# Altium project STM32_v1.PrjPcb
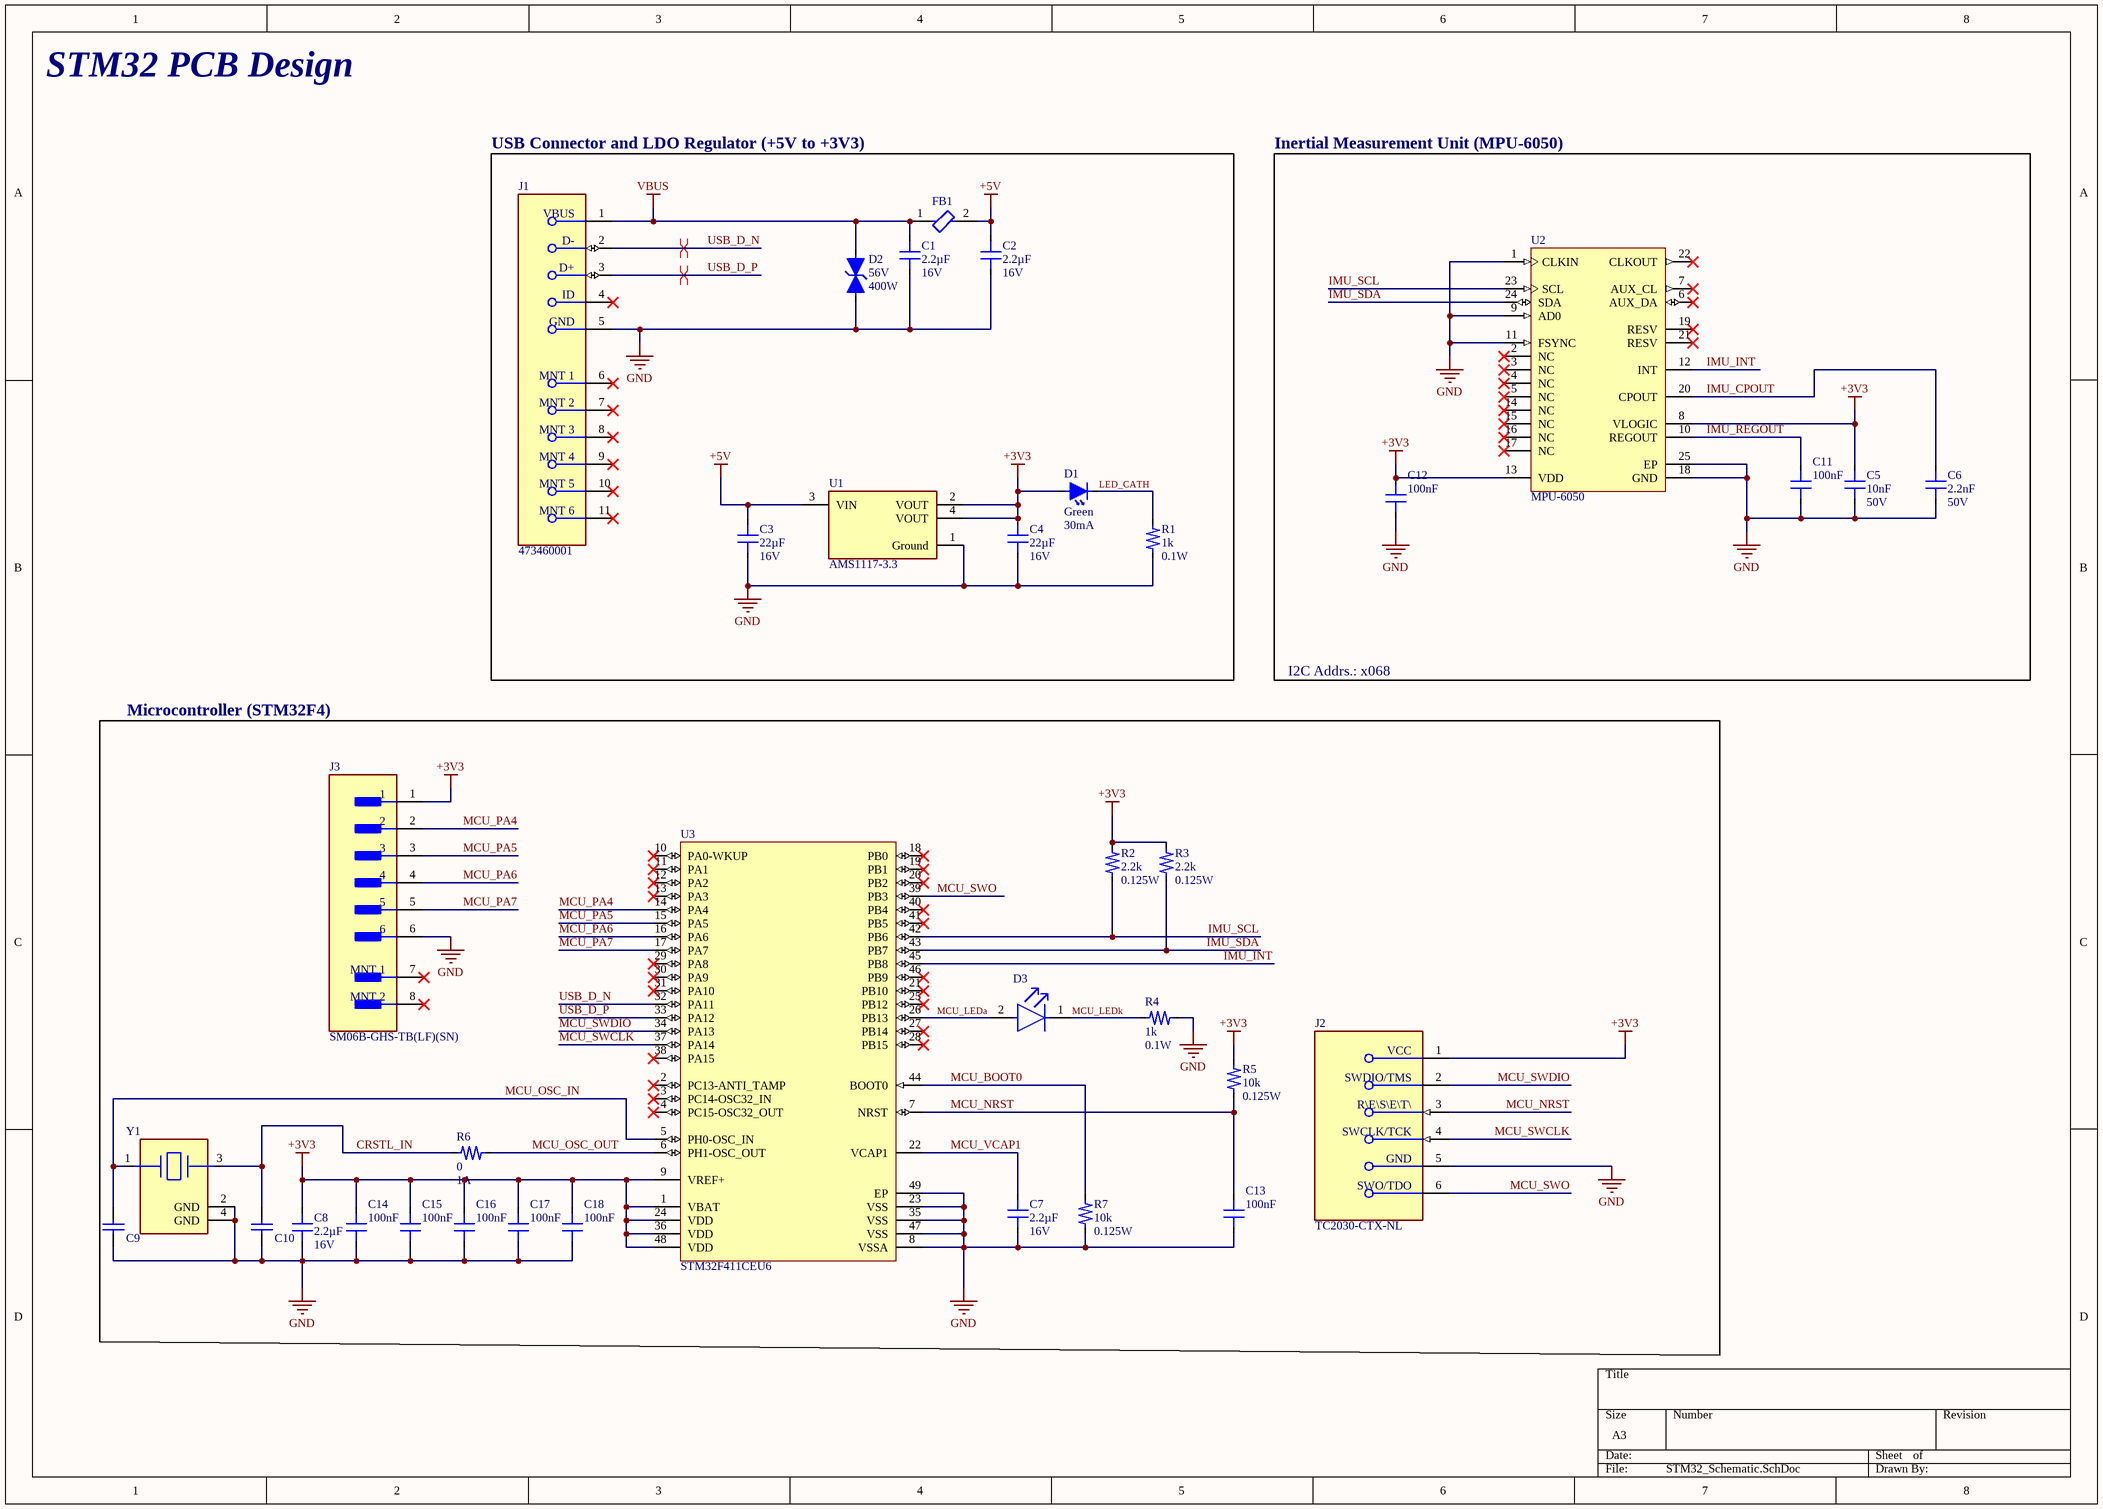
[diagram p0: STM32_Schematic.SchDoc]
1 sheet, 36 parts. Net scope: global (net labels, ports and power ports of the same name join across sheets).
Board file: STM32_PCB.PcbDoc

## Sheet STM32_Schematic.SchDoc
size A3; SheetNumber: 1; SheetTotal: 1

### Parts
C1  value 2.2µF  Rating: 16V  [C_0805]  (hidden comment: CC0805ZRY5V7BB225)
C2  value 2.2µF  Rating: 16V  [C_0805]  (hidden comment: CC0805ZRY5V7BB225)
C3  value 22µF  Rating: 16V  [C_1210]  (hidden comment: CL32A226KOJNNNE)
C4  value 22µF  Rating: 16V  [C_1210]  (hidden comment: CL32A226KOJNNNE)
C5  value 10nF  Rating: 50V  [C_0603]  (hidden comment: CC0603KRX7R9BB103)
C6  value 2.2nF  Rating: 50V  [C_0805]  (hidden comment: CC0805JKNP09BN222)
C7  value 2.2µF  Rating: 16V  [C_0805]  (hidden comment: CC0805ZRY5V7BB225)
C8  value 2.2µF  Rating: 16V  [C_0805]  (hidden comment: CC0805ZRY5V7BB225)
C9  885392005106  [WCAP-CSRF_0402]  (value not drawn)
C10  885392005106  [WCAP-CSRF_0402]  (value not drawn)
C11  value 100nF  [CAPC1005X55N]  (hidden comment: CL05B104KO5NNNC)
C12  value 100nF  [CAPC1005X55N]  (hidden comment: CL05B104KO5NNNC)
C13  value 100nF  [CAPC1005X55N]  (hidden comment: CL05B104KO5NNNC)
C14  value 100nF  [CAPC1005X55N]  (hidden comment: CL05B104KO5NNNC)
C15  value 100nF  [CAPC1005X55N]  (hidden comment: CL05B104KO5NNNC)
C16  value 100nF  [CAPC1005X55N]  (hidden comment: CL05B104KO5NNNC)
C17  value 100nF  [CAPC1005X55N]  (hidden comment: CL05B104KO5NNNC)
C18  value 100nF  [CAPC1005X55N]  (hidden comment: CL05B104KO5NNNC)
D1  value Green  Rating: 30mA  [LED_0603]  (hidden comment: FYLS-0603UGC)
D2  value 56V  Rating: 400W  [SMA]  (hidden comment: SMAJ48CA)
D3  LXZ1-PD02  [FP-LXZ1-PD02-MFG]  (value not drawn)
FB1  MMZ1608R121ATA00  [FP-MMZ1608-0_8-IPC_C]  (value not drawn)
J1  473460001  [FP-473460001-MFG]
J2  TC2030-CTX-NL  [FP-TC2030-CTX-NL-MFG]
J3  SM06B-GHS-TB(LF)(SN)  [FP-SM06B-GHS-TB_LF_SN-MFG]
R1  value 1k  Rating: 0.1W  [R_0603]  (hidden comment: CR-03FL7----1K)
R2  value 2.2k  Rating: 0.125W  [R_0805]  (hidden comment: CR-05FL7---2K2)
R3  value 2.2k  Rating: 0.125W  [R_0805]  (hidden comment: CR-05FL7---2K2)
R4  value 1k  Rating: 0.1W  [R_0603]  (hidden comment: CR-03FL7----1K)
R5  value 10k  Rating: 0.125W  [R_0805]  (hidden comment: CR-05FL7---10K)
R6  value 0  Rating: 1A  [R_0603]  (hidden comment: CR-03JL7----0R)
R7  value 10k  Rating: 0.125W  [R_0805]  (hidden comment: CR-05FL7---10K)
U1  AMS1117-3.3  [FP-AMS1117-IPC_C]
U2  MPU-6050  [IS-QFN-24_V]
U3  STM32F411CEU6  [STM-UFQFPN48_L]
Y1  ABM11-20.000MHZ-B7G-T  [FP-ABM11-MFG]  (value not drawn)

### Blocks framed on the sheet
USB Connector and LDO Regulator (+5V to +3V3): C1-C4 D1 D2 FB1 J1 R1 U1
Inertial Measurement Unit (MPU-6050): C5 C6 C11 C12 U2
Microcontroller (STM32F4): C7-C10 C13-C18 D3 J2 J3 R2-R7 U3 Y1

### Nets
+3V3: C4.2(C2) C5.2(C2) C8.2(C2) C12.1(C1) C14.1(C1) C15.1(C1) C16.1(C1) C17.1(C1) C18.1(C1) D1.2(DA) J2.1(VCC) J3.1 R2.2(R2) R3.2(R2) R5.2(R2) U1.2(VOUT) U1.4(VOUT) U2.8(VLOGIC) U2.13(VDD) U3.1(VBAT) U3.9(VREF+) U3.24(VDD) U3.36(VDD) U3.48(VDD)
+5V: C2.2(C2) C3.2(C2) FB1.2 U1.3(VIN)
GND: C1.1(C1) C2.1(C1) C3.1(C1) C4.1(C1) C5.1(C1) C6.1(C1) C7.1(C1) C8.1(C1) C9.1 C10.1 C11.2(C2) C12.2(C2) C13.2(C2) C14.2(C2) C15.2(C2) C16.2(C2) C17.2(C2) C18.2(C2) D2.2(DA) J1.5(GND) J2.5(GND) J3.6 R1.1(R1) R4.1(R1) R7.1(R1) U1.1(Ground) U2.1(CLKIN) U2.9(AD0) U2.11(FSYNC) U2.18(GND) U2.25(EP) U3.8(VSSA) U3.23(VSS) U3.35(VSS) U3.47(VSS) U3.49(EP) Y1.2(GND) Y1.4(GND)
VBUS: C1.2(C2) D2.1(DC) FB1.1 J1.1(VBUS)
CRSTL_IN: C10.2 R6.1(R1) Y1.3
IMU_CPOUT: C6.2(C2) U2.20(CPOUT)
IMU_INT: U2.12(INT) U3.45(PB8)
IMU_REGOUT: C11.1(C1) U2.10(REGOUT)
IMU_SCL: R2.1(R1) U2.23(SCL) U3.42(PB6)
IMU_SDA: R3.1(R1) U2.24(SDA) U3.43(PB7)
LED_CATH: D1.1(DC) R1.2(R2)
MCU_BOOT0: R7.2(R2) U3.44(BOOT0)
MCU_LEDa: D3.2(A) U3.26(PB13)
MCU_LEDk: D3.1(C) R4.2(R2)
MCU_NRST: C13.1(C1) J2.3(~{RESET}) R5.1(R1) U3.7(NRST)
MCU_OSC_IN: C9.2 U3.5(PH0-OSC_IN) Y1.1
MCU_OSC_OUT: R6.2(R2) U3.6(PH1-OSC_OUT)
MCU_PA4: J3.2 U3.14(PA4)
MCU_PA5: J3.3 U3.15(PA5)
MCU_PA6: J3.4 U3.16(PA6)
MCU_PA7: J3.5 U3.17(PA7)
MCU_SWCLK: J2.4(SWCLK/TCK) U3.37(PA14)
MCU_SWDIO: J2.2(SWDIO/TMS) U3.34(PA13)
MCU_SWO: J2.6(SWO/TDO) U3.39(PB3)
MCU_VCAP1: C7.2(C2) U3.22(VCAP1)
USB_D_N: J1.2(D-) U3.32(PA11)
USB_D_P: J1.3(D+) U3.33(PA12)

Not connected (* = marked no-connect by the designer): J1 4(ID)* 6(MNT_1)* 7(MNT_2)* 8(MNT_3)* 9(MNT_4)* 10(MNT_5)* 11(MNT_6)*; J3 7(MNT_1)* 8(MNT_2)*; U2 2(NC)* 3(NC)* 4(NC)* 5(NC)* 6(AUX_DA)* 7(AUX_CL)* 14(NC)* 15(NC)* 16(NC)* 17(NC)* 19(RESV)* 21(RESV)* 22(CLKOUT)*; U3 2(PC13-ANTI_TAMP)* 3(PC14-OSC32_IN)* 4(PC15-OSC32_OUT)* 10(PA0-WKUP)* 11(PA1)* 12(PA2)* 13(PA3)* 18(PB0)* 19(PB1)* 20(PB2)* 21(PB10)* 25(PB12)* 27(PB14)* 28(PB15)* 29(PA8)* 30(PA9)* 31(PA10)* 38(PA15)* 40(PB4)* 41(PB5)* 46(PB9)*

### Layout directives
differential pair; net class USB_DIFF: USB_D_N, USB_D_P

### Notes on the sheet
- STM32 PCB Design
- I2C Addrs.: x068

### Library data of the parts
C1 C2 C7 C8 = CMP-001-00541-2: Tolerance: 20%; Type: Chip Capacitor; Part Number: CC0805ZRY5V7BB225; NI PEN/DEB: -; Case/Package: 0805; Order Number: 82-01-80; Distributor: Lomex; Design Item ID: CC0805ZRY5V7BB225; Price (HUF): 2.00; Source: CC0805ZRY5V7BB225.Schlib; Link: http://lomex.hu/hu/webshop/#/page,0/search,82-01-80/stype,1/sidx,1; NI Part Number: -
C3 C4 = CMP-001-00660-2: Tolerance: 10%; Type: Chip Capacitor; NI PEN/DEB: -; Link: http://lomex.hu/hu/webshop/#/page,0/search,82-08-05/stype,1/sidx,1; NI Part Number: -; Case/Package: 1210; Order Number: 82-08-05; Part Number: CL32A226KOJNNNE; Distributor: Lomex; Price (HUF): 2.00; Design Item ID: CL32A226KOJNNNE; Source: CL32A226KOJNNNE.Schlib
C5 = CMP-001-00451-5: Type: Chip Capacitor; Tolerance: 10%; NI PEN/DEB: -; Case/Package: 0603; NI Part Number: -; Price (HUF): 2.00; Part Number: CC0603KRX7R9BB103; Design Item ID: CC0603KRX7R9BB103; Distributor: Lomex; Source: CC0603KRX7R9BB103.Schlib; Link: http://lomex.hu/hu/webshop/#/page,0/search,82-02-45/stype,1/sidx,1; Order Number: 82-02-45
C6 = CMP-001-00483-2: Type: Chip Capacitor; Tolerance: 5%; Distributor: Lomex; Order Number: 82-04-70; Design Item ID: CC0805JKNP09BN222; NI PEN/DEB: -; NI Part Number: -; Case/Package: 0805; Price (HUF): 2.00; Part Number: CC0805JKNP09BN222; Source: CC0805JKNP09BN222.Schlib; Link: http://lomex.hu/hu/webshop/#/page,0/search,82-04-70/stype,1/sidx,1
C9 C10 = CMP-001-00057-1: WCAP-CSRF Multilayer Ceramic Chip Capacitor High Frequency, size 0402, NP0 Class I, 10pF, 50VDC; Manufacturer: Wurth Elektronik; Rated Voltage (DC): 50V; Technical Reference: NP00402100J050DFCT1R000; Insulation Resistance: 10GOhm; Capacitance Tolerance: +/-5%; Q Factor: 600; Height: 0.5mm; ComponentLink2URL: https://www.we-online.com/redexpert/spec/885392005106?ad; Case/Package: 0402; ComponentLink1Description: Website Link; Width: 0.5mm; ComponentLink2Description: Datasheet Link; Ceramic Type: NP0 Class I; ComponentLink1URL: https://www.we-online.com/redexpert/article/885392005106?ad; Manufacturer Part Number: 885392005106; Operating Temperature Min: -55°C; Length: 1mm; Design Item ID: 885392005106; Category: Multilayer Ceramic Chip Capacitors; Source: WCAP-CSRF.SchLib; Value: 10pF; Match Code: WCAP-CSRF; Packaging: Tape and Reel; Operating Temperature Max: 125°C; Mount: Surface Mount
C11-C18 = CMP-001-00022-1: Multilayer Ceramic Capacitor, 0.1 uF, 16 V, ï¿½ 10%, X7R, 0402 [1005 Metric]; Manufacturer_Name: SAMSUNG; Geometry.Height: 0.55mm; Voltage: 16V; RoHS Compliant: Yes; Dielectric: X7R; Order Number: 82-08-44; Series: CL; Packaging: Tape and Reel; Lead Free: Lead Free; Length: 1mm; Tolerance: 10%; Mouser Part Number: 187-CL05B104KO5NNNC; Manufacturer_Part_Number: CL05B104KO5NNNC; Source: CL05A105KO5NNNC.SchLib; Case Code (Metric): 1005; Case Code (Imperial): 0402; Radiation Hardening: No; Mouser Price/Stock: https://www.mouser.co.uk/ProductDetail/Samsung-Electro-Mechanics/CL05B104KO5NNNC?qs=hqM3L16%252BxlfT2SKOuAUq6Q%3D%3D; Datasheet Link: https://datasheet.datasheetarchive.com/originals/distributors/Datasheets-DGA10/2408147.pdf; Material: Ceramic; Mounting Technology: Surface Mount; Package Quantity: 1; Voltage Rating (DC): 16V; Max Operating Temperature: 125°C; Min Operating Temperature: -55°C; Width: 0.02inch; Voltage Rating: 16V; Design Item ID: CL05A105KO5NNNC; Height: 0.5mm; Construction: Flat; Thickness: 0.022inch; Depth: 0.5mm; Case/Package: 0402
D1 = CMP-004-00082-2: Type: LED; Note: 40mcd; Link: http://lomex.hu/hu/webshop/#/page,0/stype,1/sidx,10/instock,0/search,95-03-08; NI part number: -; Source: FYLS-0603UGC.Schlib; Case/Package: 0603; Order Number: 95-03-08; Part Number: FYLS-0603UGC; Price (HUF): 10; NI PEN/DEB: -; Distributor: Lomex; Design Item ID: FYLS-0603UGC
D2 = CMP-004-00087-1: bidirectional; Type: Transient Voltage Suppressor; Case/Package: SMA; Part Number: SMAJ48CA; Order Number: 96-04-63; Distributor: Lomex; Link: https://lomex.hu/hu/webshop/#/search,96-04-63/stype,1; NI PEN/DEB: -; Design Item ID: SMAJ48CA; Price (HUF): 20; NI part number: -
D3 = CMP-224022-000002-1: LUXEON Z High Power SMT LED Emitter Red Lambertian 500mA 2.15 V; RoHS Compliant: Yes; Lead Free: Lead Free
FB1 = CMP-08257-000251-1: Signal Line Ferrite Bead 120Ω  @ 100MHz 500mA DCR 180mΩ SMD 0603; Tolerance: 25%; DC Resistance (DCR): 180mR; Impedance: 120R; Core Material: Ferrite; Current Rating: 500mA; Max DC Current: 500mA; Width: 0.031inch; Series: MMZ; Length: 0.063inch; Height: 0.037inch; REACH SVHC: No SVHC; Case/Package: 0603; Case Code (Imperial): 0603; Packaging: Tape and Reel; Case Code (Metric): 1608; Package Quantity: 4000; RoHS Compliant: Yes; Mount: Surface Mount
J1 = CMP-2000-05246-2: CONN RCPT USB2.0 MICRO B SMD R/A; Manufacturer: Molex; Conn Orientation: Right Angle; Is Female: yes; Shielding: true; Pitch: 0.65mm; Number Of Contacts: 5; Voltage Rating: 30V; Current Rating: 1.8A; Device Class L2: USB Connectors; Digikey Description: CONN RCPT USB2.0 MICRO B SMD R/A; Height: 2.945mm; RoHS: TRUE; ComponentLink2Description: Datasheet; Octopart: https://octopart.com/47346-0001-molex-7164928; Automotive: No; Package: 0; Category: Conn; Device Class L1: Connectors; Usb Standard: USB 2.0; Temperature: -30°C to +85°C; Temperature Range Low: -30°C; Footprint Url: https://www.molex.com/pdm_docs/sd/473460001_sd.pdf; ComponentLink2URL: https://www.molex.com/webdocs/datasheets/pdf/en-us/0473460001_IO_CONNECTORS.pdf; Lead Free: Yes; Manufacturer Part Number: 473460001; Contact Material: Gold,Nickel; Temperature Range High: +85°C; Device Class L3: unset
J2 = CMP-205963-000001-1: 6-Pin “No legs” TC2030 Plug-of-Nails™ Cable for use with ARM Cortex processors
J3 = CMP-17439-000061-1: CONN HEADER SMD R/A 6POS 1.25MM; Number of Contacts: 6; Voltage Rating: 50V; Current Rating: 1A; Connector Type: Outer Shroud Contact; Contact Resistance: 50mR; Orientation: Right Angle; Max Operating Temperature: 85°C; Mount: Surface Mount; Packaging: Tape and Reel; Contact Plating: Tin; Depth: 4.05mm; Max Voltage Rating (AC): 50V; Lead Free: Lead Free; Pitch: 1.25mm; Number of Positions: 6; Max Current Rating: 1A; Termination: Solder; Min Operating Temperature: -25°C; Housing Color: Beige; Fastening Type: Ramp; Length: 10.75mm; Color: Natural; Contact Material: Bronze; Housing Material: Polyamide; Number of Rows: 1
R1 R4 = CMP-009-00002-5: NI part number: 713776-01; NI PEN/DEB: DEB; Tolerance: 1%; Order Number: 80-11-59; Design Item ID: CR-03FL7----1K; Price (HUF): 0.80; Type: Chip Resistor; Link: http://lomex.hu/hu/webshop/#/page,0/search,80-11-59/stype,1/sidx,1; Distributor: Lomex; Part Number: CR-03FL7----1K; Case/Package: 0603; Source: CR-03FL7----1K.Schlib
R2 R3 = CMP-009-00296-3: Tolerance: 1%; NI part number: -; NI PEN/DEB: -; Order Number: 80-10-90; Case/Package: 0805; Part Number: CR-05FL7---2K2; Price (HUF): 0.80; Source: CR-05FL7---2K2.Schlib; Design Item ID: CR-05FL7---2K2; Type: Chip Resistor; Distributor: Lomex; Link: http://lomex.hu/hu/webshop/#/page,0/search,80-10-90/stype,1/sidx,1
R5 R7 = CMP-009-00315-3: Tolerance: 1%; Part Number: CR-05FL7---10K; NI PEN/DEB: -; Type: Chip Resistor; Distributor: Lomex; NI part number: -; Order Number: 80-10-98; Price (HUF): 0.80; Source: CR-05FL7---10K.Schlib; Case/Package: 0805; Link: http://lomex.hu/hu/webshop/#/page,0/search,80-10-98/stype,1/sidx,1; Design Item ID: CR-05FL7---10K
R6 = CMP-009-00264-5: NI part number: 611560-01; NI PEN/DEB: DEB; Tolerance: 5%; Distributor: Lomex; Case/Package: 0603; Part Number: CR-03JL7----0R; Type: Chip Resistor; Order Number: 81-10-01; Design Item ID: CR-03JL7----0R; Price (HUF): 0.80; Link: http://lomex.hu/hu/webshop/#/page,0/search,81-10-01/stype,1/sidx,1; Source: CR-03JL7----0R.Schlib
U1 = CMP-209535-000001-1: LDO Voltage Regulators 1A, 3.3V; Manufacturer: Advanced Monolithic Systems; Dropout Voltage: 1.1V; Output Type: Fixed; Nominal Supply Current: 5mA; Max Power Dissipation: 1.2W; Max Supply Voltage: 15V; Number Of Outputs: 1; Standoff Height: 0.64mm; Max Junction Temp: +125°C; Height: 1.8mm; Package: AMS1117; Device Class L2: Power Management ICs; ComponentLink2Description: Datasheet; ComponentLink2URL: http://www.advanced-monolithic.com/pdf/ds1117.pdf; Category: IC; RoHS: TRUE; Automotive: No; Device Class L1: Integrated Circuits (ICs); Output Current: 1A; Device Class L3: Voltage Regulators - Linear; Temperature: -40°C to +125°C; Output Voltage: 3.3V; Manufacturer Part Number: AMS1117-3.3; Temperature Range Low: -40°C; Octopart: https://octopart.com/ams1117-3.3-advanced+monolithic+systems-25899300; Lead Free: Yes; Ipc Land Pattern Name: SOT229P700X180-4; Temperature Range High: +125°C
U2 = CMP-1753-00002-2: 3-Axis Gyroscope, Accelerometer and a Digital Motion Processor(TM) (DMP), 2.375 to 3.46 V, -40 to 85 degC, 24-Pin QFN, RoHS, Tape and Reel; Manufacturer: InvenSense; Featured Product: MPU-60506-Axis,IntegratedI²CSolution; Other Names: 1428-1007-2 / MPU6050; Sensor Type: MotionTracking; Online Catalog: MPU-6000™Series; Unit PriceUSD: Digital; Datasheet Version: Rev. 3.3, 05/2012; Category: Sensors,Transducers; Datasheet URL: http://datasheet.octopart.com/MPU-6050-InvenSense-datasheet-14421344.pdf; Family: Multifunction; Standard Package: 5,000; Manufacturer URL: http://www.invensense.com/; Output Type: Digital; Dynamic Catalog: MPU-6000™Series
U3 = CMP-0243-00165-1: ARM Cortex-M4 32-bit MCU+FPU, 512 KB Flash, 128 KB RAM, 36 I/Os, 48-Pin UFQFPN, -40 to 85 degC, Tray; Operating Frequency(F) (Processor speed) (MHz): 100; FLASH Size (Prog) (kB): 512; Internal RAM Size (kB): 128; I/Os (High Current): 36; Supply Voltage(Vcc) min (V): 1.7; Package Reference: 48-Pin Ultra Thin Fine Pitch Quad Flat No-Lead, 7 x 7 x 0.6 mm Body, 0.5 mm Pitch, Exposed Pad; ComponentLink1Description: Manufacturer URL; ComponentLink1URL: http://www.st.com/; Packing: Tray; Package Description: UFQFPN48; Core: ARM Cortex-M4; ComponentLink2Description: Datasheet; ComponentLink2URL: http://www.st.com/st-web-ui/static/active/en/resource/technical/document/datasheet/DM00115249.pdf; DatasheetVersion: Rev. 6; Mounting Technology: Surface Mount
Y1 = CMP-27762-009397-1: Crystal 20MHz ±15ppm 10pF SMD-4 2mm x 1.6mm; ESR (Equivalent Series Resistance): 120R; Min Operating Temperature: -20°C; Termination: SMD/SMT; Case/Package: SMD/SMT; Max Operating Temperature: 70°C; Package Quantity: 1000; Width: 0.063inch; Series: ABM11; Mount: Surface Mount; Frequency: 20MHz; Load Capacitance: 10pF; Frequency Stability: 15ppm; Length: 0.079inch; Number of Pins: 4; Frequency Tolerance: 15ppm; Tolerance: 15ppm; Series Resistance: 120R; Packaging: Tape and Reel; Height: 0.023inch